# Altium schematic sheet [01] - COVER PAGE.SchDoc
size A3; DocumentNumber: 1; SheetNumber: 1; SheetTotal: 18
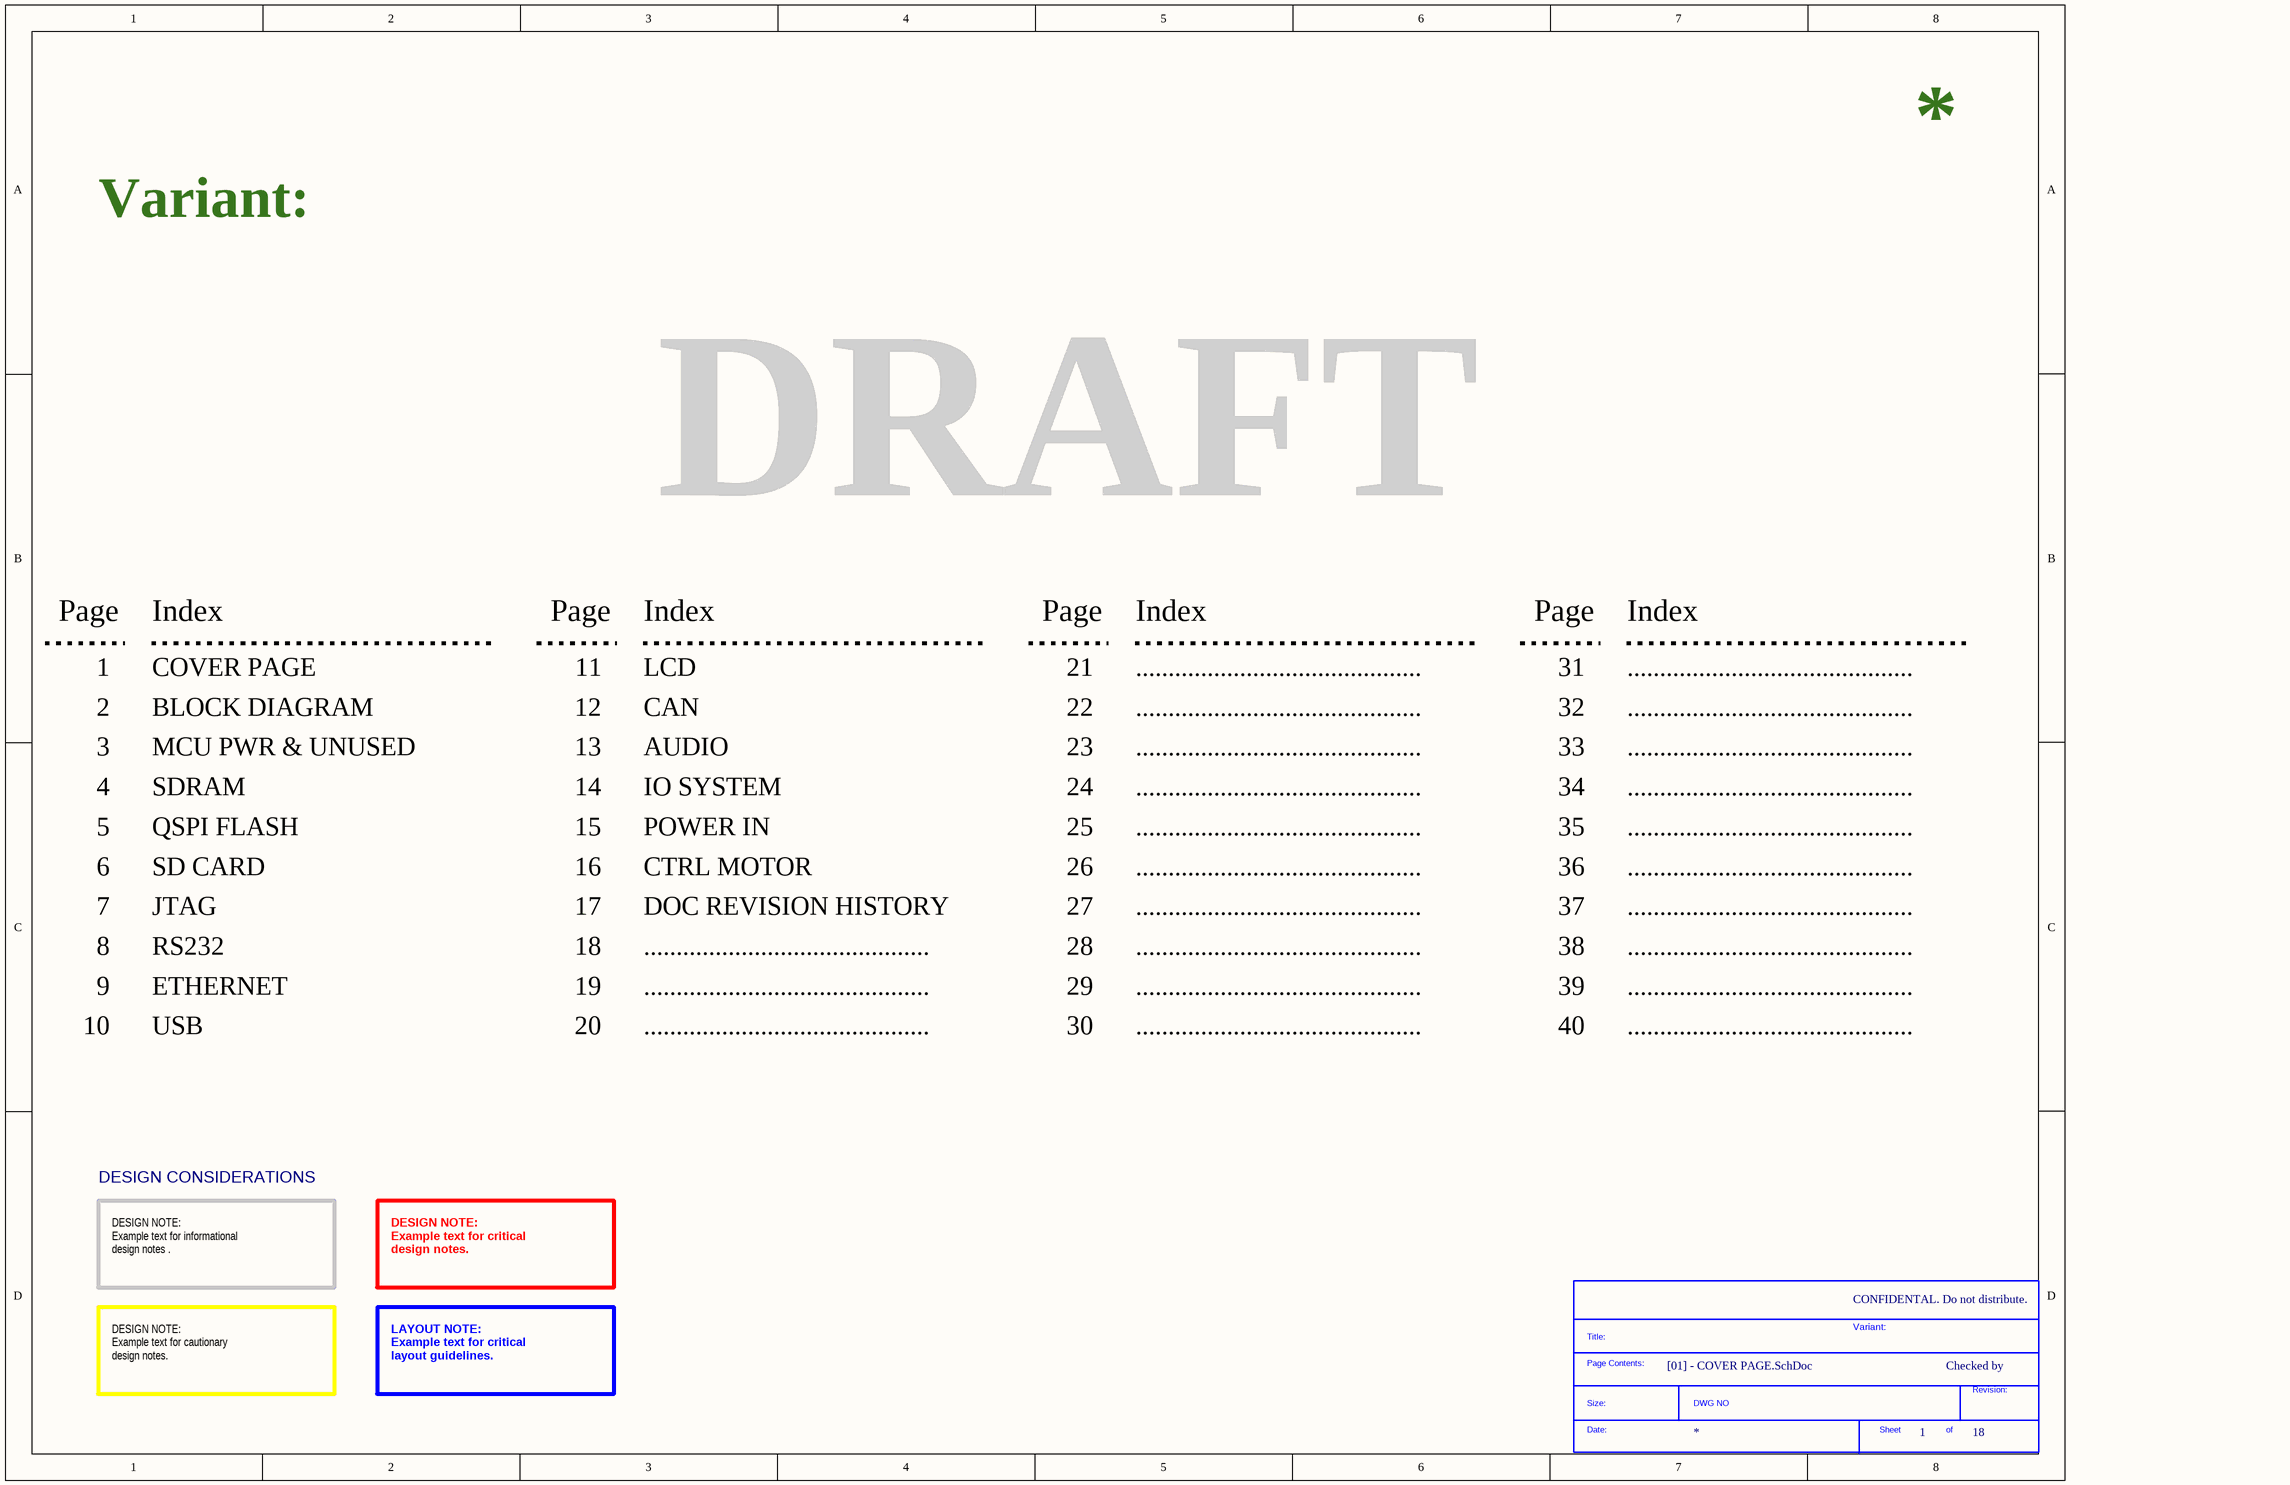
[diagram p0: [01] - COVER PAGE.SchDoc]

## Parts
*  SDTitleBlock  (value not drawn)  (graphical)

## Notes on the sheet
- Variant:
- DRAFT
- Page
- Index
- 1
- COVER PAGE
- 11
- LCD
- 21
- ............................................
- 31
- 2
- 3
- BLOCK DIAGRAM
- MCU PWR & UNUSED
- 12
- 13
- CAN
- AUDIO
- 22
- 23
- 32
- 33
- 4
- 5
- SDRAM
- QSPI FLASH
- 14
- 15
- IO SYSTEM
- POWER IN
- 24
- 25
- 34
- 35
- 6
- SD CARD
- 16
- CTRL MOTOR
- 26
- 36
- 7
- 8
- JTAG
- RS232
- 17
- 18
- DOC REVISION HISTORY
- 27
- 28
- 37
- 38
- 9
- 10
- ETHERNET
- USB
- 19
- 20
- 29
- 30
- 39
- 40
- DESIGN CONSIDERATIONS
- DESIGN NOTE:
  Example text for informational
  design notes .
- DESIGN NOTE:
  Example text for critical
  design notes.
- CONFIDENTAL. Do not distribute.
- Checked by
- DESIGN NOTE:
  Example text for cautionary
  design notes.
- LAYOUT NOTE:
  Example text for critical
  layout guidelines.
- (in symbol SDTitleBlock) Title:; Page Contents:; Revision:; Size:; DWG NO; Date:; Sheet; of